# EAGLE design EYIC AD11 (EAGLE 9.6.2)
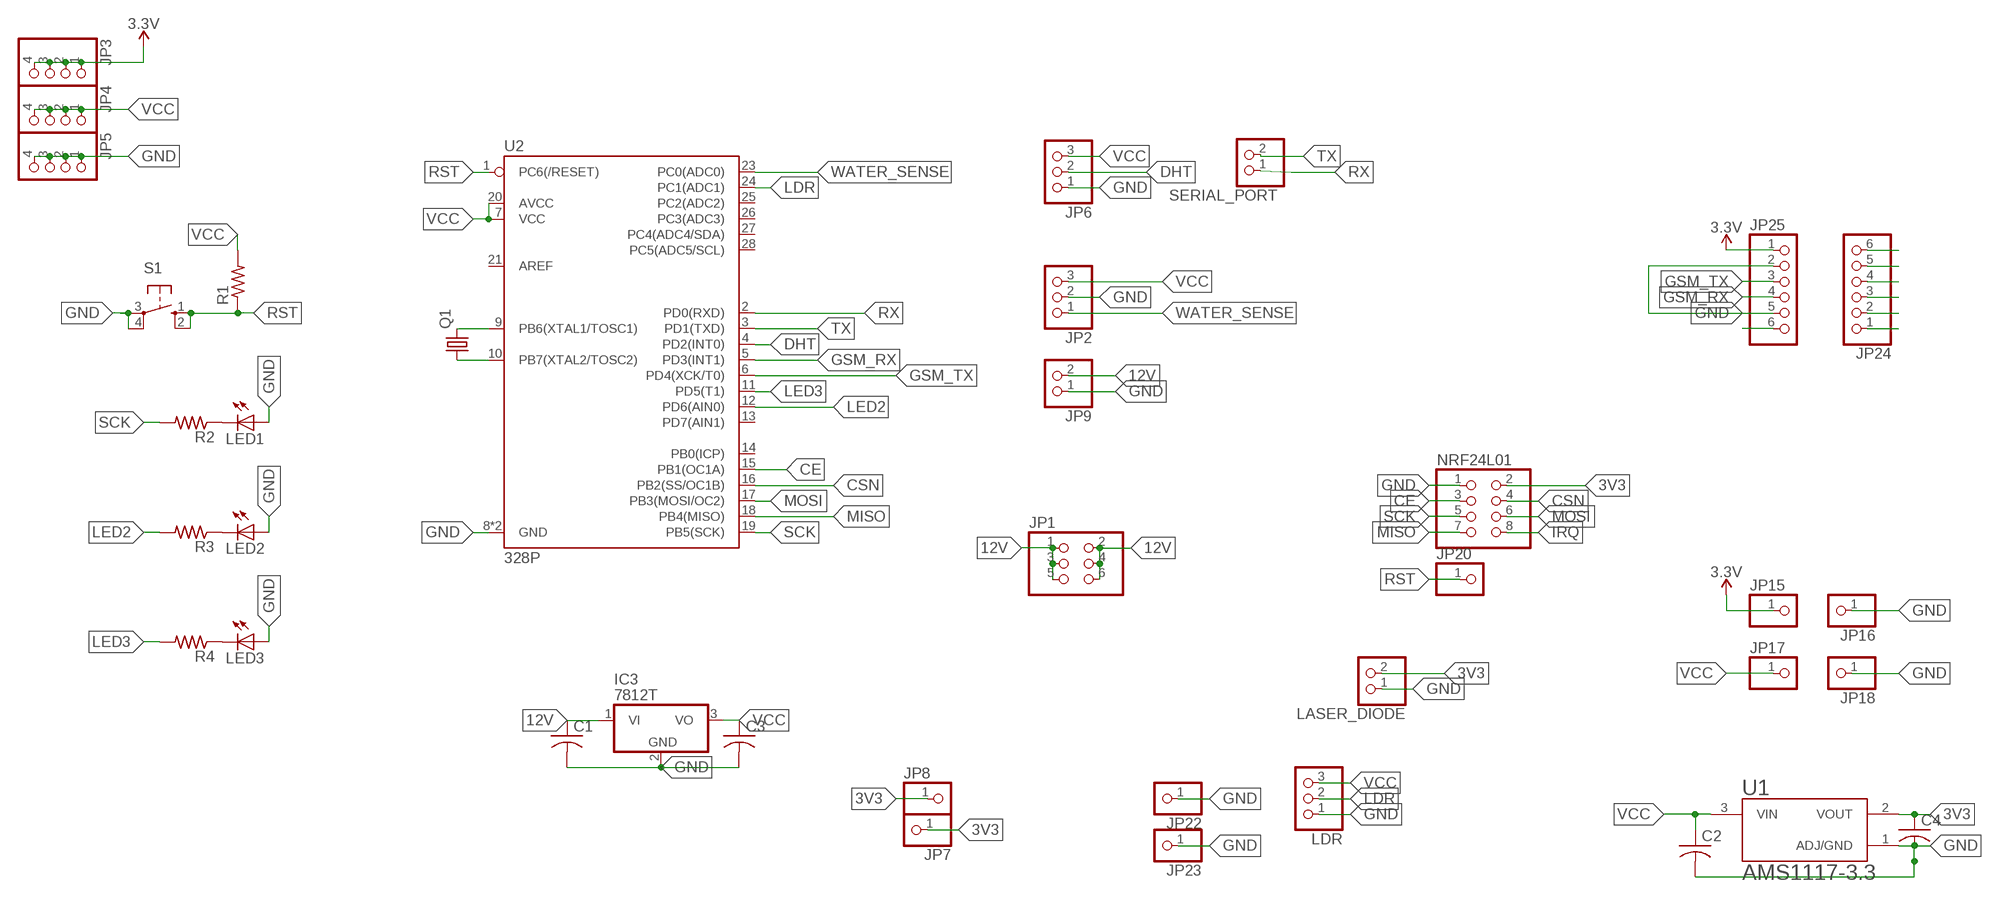
[diagram p0: schematic, sheet 1]

## Parts
C1  C-US050-035X075  [C050-035X075]
C2  C-US025-060X050  [C025-060X050]
C3  C-US050-035X075  [C050-035X075]
C4  C-US025-060X050  [C025-060X050]
IC3  7812T  [TO220H]
JP1  PINHD-2X3  [2X03]
JP2  PINHD-1X3  [1X03]
JP3  PINHD-1X4  [1X04]
JP4  PINHD-1X4  [1X04]
JP5  PINHD-1X4  [1X04]
JP6  PINHD-1X3  [1X03]
JP7  PINHD-1X1  [1X01]
JP8  PINHD-1X1  [1X01]
JP9  PINHD-1X2  [1X02]
JP15  PINHD-1X1  [1X01]
JP16  PINHD-1X1  [1X01]
JP17  PINHD-1X1  [1X01]
JP18  PINHD-1X1  [1X01]
JP20  PINHD-1X1  [1X01]
JP22  PINHD-1X1  [1X01]
JP23  PINHD-1X1  [1X01]
JP24  PINHD-1X6  [1X06]
JP25  PINHD-1X6  [1X06]
LASER_DIODE  PINHD-1X2  [1X02]
LDR  PINHD-1X3  [1X03]
LED1  LED5MM  [LED5MM]
LED2  LED5MM  [LED5MM]
LED3  LED5MM  [LED5MM]
NRF24L01  PINHD-2X4  [2X04]
Q1  CRYSTALHC49S  [HC49/S]
R1  R-US_0207/7  [0207/7]
R2  R-US_0207/7  [0207/7]
R3  R-US_0207/7  [0207/7]
R4  R-US_0207/7  [0207/7]
S1  10-XX  [B3F-10XX]
SERIAL_PORT  PINHD-1X2  [1X02]
U1  AMS1117-3.3  [SOT229P700X180-4N]
U2  328P  ATMEGA328P_PDIP  [DIP28]

## Nets
3.3V: JP3.1 JP3.2 JP3.3 JP3.4 JP15.1 JP25.1
3V3: C4.1 JP7.1 JP8.1 LASER_DIODE.2 NRF24L01.2 U1.2(VOUT)
12V: C1.1 IC3.1(VI) JP1.1 JP1.2 JP1.3 JP1.4 JP1.5 JP1.6 JP9.2
CE: NRF24L01.3 U2.15(PB1(OC1A))
CSN: NRF24L01.4 U2.16(PB2(SS/OC1B))
DHT: JP6.2 U2.4(PD2(INT0))
GND: C1.2 C2.2 C3.2 C4.2 IC3.2(GND) JP2.2 JP5.1 JP5.2 JP5.3 JP5.4 JP6.1 JP9.1 JP16.1 JP18.1 JP22.1 JP23.1 JP25.2 JP25.5 LASER_DIODE.1 LDR.1 LED1.A LED2.A LED3.A NRF24L01.1 S1.3(P) S1.4(P1) U1.1(ADJ/GND) U2.8(GND) U2.22(GND)
GSM_RX: JP25.4 U2.5(PD3(INT1))
GSM_TX: JP25.3 U2.6(PD4(XCK/T0))
IRQ: NRF24L01.8
LDR: LDR.2 U2.24(PC1(ADC1))
LED2: R3.2 U2.12(PD6(AIN0))
LED3: R4.2 U2.11(PD5(T1))
MISO: NRF24L01.7 U2.18(PB4(MISO))
MOSI: NRF24L01.6 U2.17(PB3(MOSI/OC2))
N$1: Q1.2 U2.9(PB6(XTAL1/TOSC1))
N$2: Q1.1 U2.10(PB7(XTAL2/TOSC2))
N$5: LED1.K(C) R2.1
N$8: LED2.K(C) R3.1
N$9: LED3.K(C) R4.1
N$11: JP25.6
N$12: JP24.6
N$13: JP24.5
N$14: JP24.4
N$15: JP24.3
N$16: JP24.2
N$17: JP24.1
RST: JP20.1 R1.1 S1.1(S) S1.2(S1) U2.1(PC6(/RESET))
RX: SERIAL_PORT.1 U2.2(PD0(RXD))
SCK: NRF24L01.5 R2.2 U2.19(PB5(SCK))
TX: SERIAL_PORT.2 U2.3(PD1(TXD))
VCC: C2.1 C3.1 IC3.3(VO) JP2.3 JP4.1 JP4.2 JP4.3 JP4.4 JP6.3 JP17.1 LDR.3 R1.2 U1.3(VIN) U2.7(VCC) U2.20(AVCC)
WATER_SENSE: JP2.1 U2.23(PC0(ADC0))
Unconnected: U2.13(PD7(AIN1)) U2.14(PB0(ICP)) U2.21(AREF) U2.25(PC2(ADC2)) U2.26(PC3(ADC3)) U2.27(PC4(ADC4/SDA)) U2.28(PC5(ADC5/SCL))

## Library data of the parts
C1-C4 = adafruit:C-US: CAPACITOR, American symbol
IC3 = adafruit:78*: Positive VOLTAGE REGULATOR Added bigger pads to the TO-92 package
JP1 = pinhead:PINHD-2X3: PIN HEADER
JP2 JP6 LDR = adafruit:PINHD-1X3: PIN HEADER
JP3-JP5 = pinhead:PINHD-1X4: PIN HEADER
JP7 JP8 JP15-JP18 JP20 JP22 JP23 = adafruit:PINHD-1X1: Pin header 1x1 for 0.1" spacing With round pins
JP9 LASER_DIODE SERIAL_PORT = pinhead:PINHD-1X2: PIN HEADER
JP24 JP25 = adafruit:PINHD-1X6: PIN HEADER; SPICEPREFIX: X
LED1-LED3 = adafruit:LED: LED OSRAM: - CHIPLED LG R971, LG N971, LY N971, LG Q971, LY Q971, LO R971, LY R971 LH N974, LH R974 LS Q976, LO Q976, LY Q976 LO Q996 - Hyper CHIPLED LW Q18S LB Q993, LB Q99A, LB R99A - SideLED LS A670, LO A670, LY A670, LG A670, LP A670 LB A673, LV A673, LT A673, LW A673 LH A674 LY A675 LS A676, LA A676, LO A676, LY A676, LW A676 LS A679, LY A679, LG A679 - Hyper Micro SIDELED® LS Y876, LA Y876, LO Y876, LY Y876 LT Y87S - SmartLED LW L88C, LW L88S LB L89C, LB L89S, LG L890 LS L89K, LO L89K, LY L89K LS L896, LA L896, LO L896, LY L896 - TOPLED LS T670, LO T670, LY T670, LG T670, LP T670 LSG T670, LSP T670, LSY T670, LOP T670, LYG T670 LG T671, LOG T671, LSG T671 LB T673, LV T673, LT T673, LW T673 LH T674 LS T676, LA T676, LO T676, LY T676, LB T676, LH T676, LSB T676, LW T676 LB T67C, LV T67C, LT T67C, LS T67K, LO T67K, LY T67K, LW E67C LS E67B, LA E67B, LO E67B, LY E67B, LB E67C, LV E67C, LT E67C LW T67C LS T679, LY T679, LG T679 LS T770, LO T770, LY T770, LG T770, LP T770 LB T773, LV T773, LT T773, LW T773 LH T774 LS E675, LA E675, LY E675, LS T675 LS T776, LA T776, LO T776, LY T776, LB T776 LHGB T686 LT T68C, LB T68C - Hyper Mini TOPLED® LB M676 - Mini TOPLED Santana® LG M470 LS M47K, LO M47K, LY M47K Source: http://www.osram.convergy.de/
NRF24L01 = adafruit:PINHD-2X4: PIN HEADER
Q1 = crystal:CRYSTAL: CRYSTAL; OC_FARNELL: 1667008; OC_NEWARK: unknown
R1-R4 = adafruit:R-US_: RESISTOR, American symbol
S1 = switch-omron:10-XX: OMRON SWITCH; MPN: B3F-1000; OC_FARNELL: 176432; OC_NEWARK: 36M3542
U1 = AMS1117-3.3:AMS1117-3.3: Sot223/Pkg 1-Amp 3.3-Volt Low Drop Out Voltage Regulatator; AVAILABILITY: Unavailable; DESCRIPTION: Sot-89; MF: Advanced Monolithic Systems; MP: AMS1117-3.3; PACKAGE: SOT-89 ams; PRICE: None
U2 = SparkFun-IC-Microcontroller:ATMEGA328P_PDIP: Atmel 328P Through hole ATMEGA328P uC used in the Arduino 32kb flash, 1k EEPROM, 2k SRAM Datasheet <http://www.sparkfun.com/datasheets/Components/SMD/ATMega328.pdf> SparkFun Products Storefront component: AVR 28 Pin 20MHz 32K 6A/D - ATMega328P <https://www.sparkfun.com/products/9061> (COM-09061) SparkFun Simon Says - Through-Hole Soldering Kit <https://www.sparkfun.com/products/10547> (KIT-10547) SparkFun Learn to Solder - Simon Says <https://www.sparkfun.com/products/13708> (KIT-13708) SparkFun BigTime Watch Kit <https://www.sparkfun.com/products/11734> (KIT-11734) SparkFun ClockIt <https://www.sparkfun.com/products/10930> (KIT-10930) SparkFun Serial Enabled LCD Kit <https://www.sparkfun.com/products/10097> (LCD-10097) SparkFun Simon Tilts - Through Hole Soldering Kit <https://www.sparkfun.com/products/12634> (KIT-12634) SparkFun Frequency Counter Kit <https://www.sparkfun.com/products/10140> (KIT-10140) FabFM Radio Kit <https://www.sparkfun.com/products/11043> (KIT-11043) SparkFun Binary Blaster Kit <https://www.sparkfun.com/products/12037> (KIT-12037) SparkFun Metro-Gnome <https://www.sparkfun.com/products/9236> (KIT-09236) ATmega328 with Arduino Optiboot (Uno) <https://www.sparkfun.com/products/10524> (DEV-10524); PROD_ID: IC-09136

## Net classes
1 New Class: width 1.016 mm

## Board
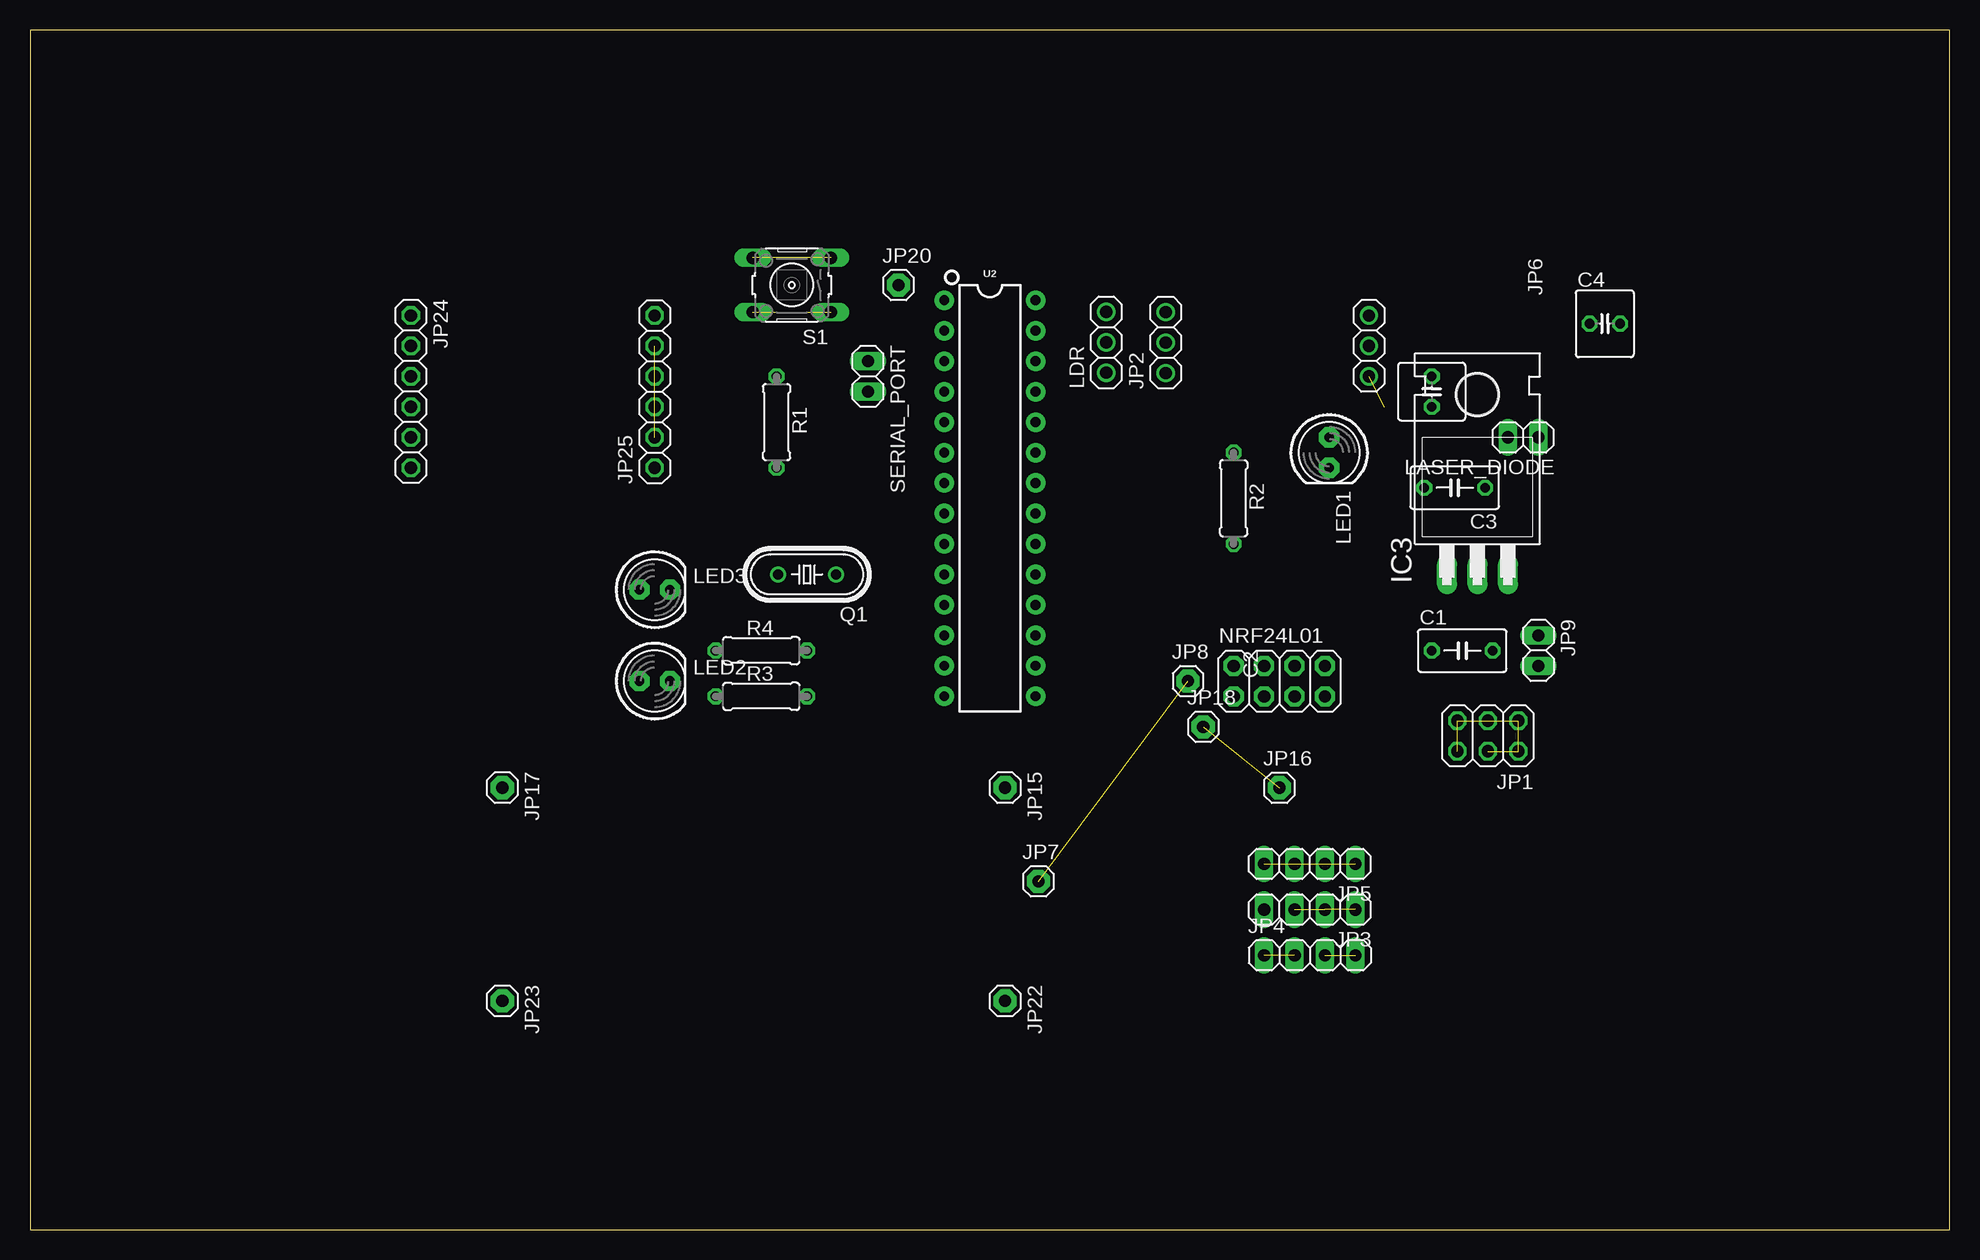
[diagram p1: board, top side]
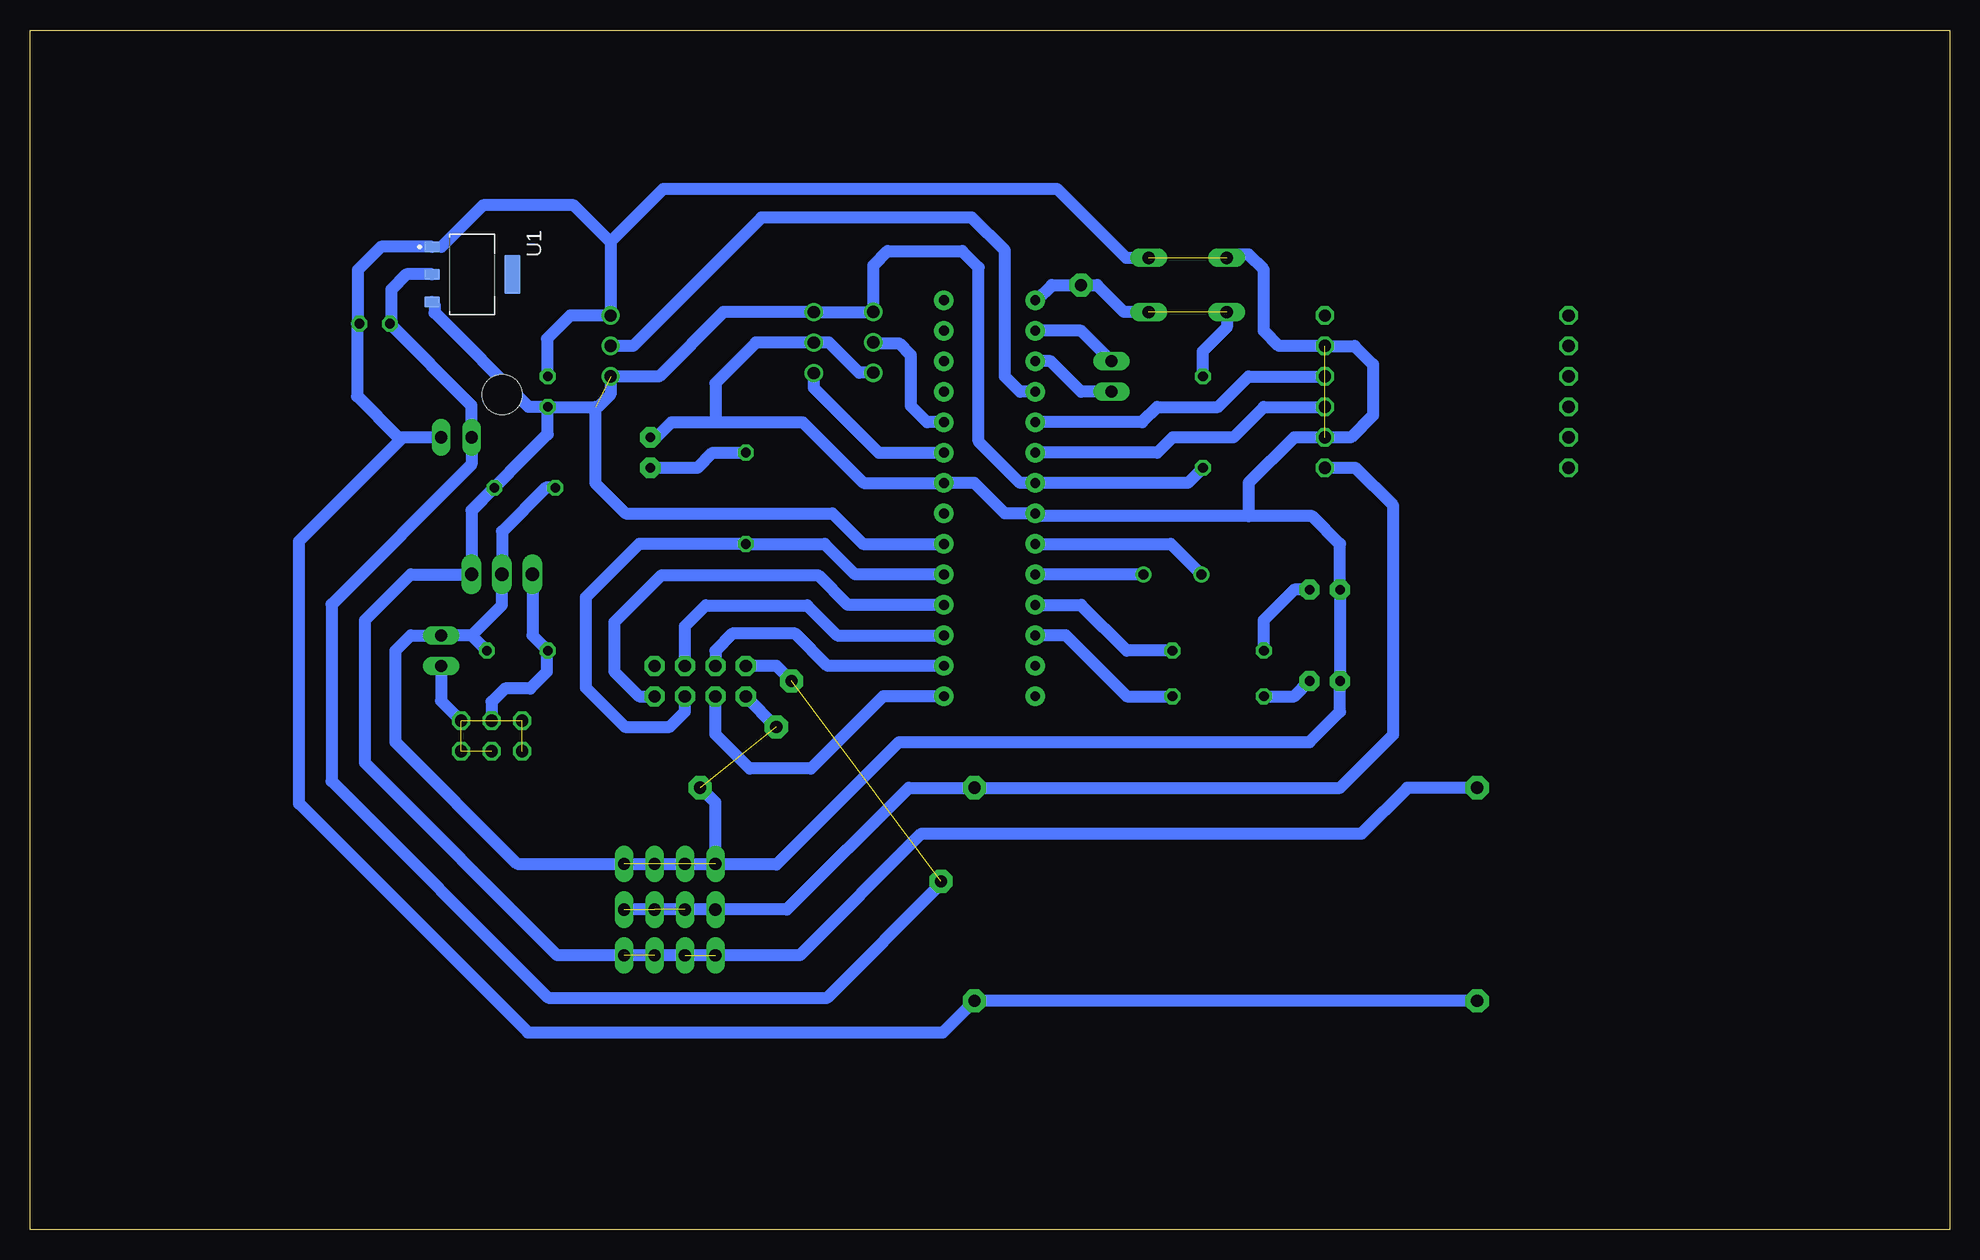
[diagram p2: board, bottom side, seen from below]

Size 160 x 100 mm. Coordinates in mm from the lower left corner, seen from the top.
Outline: 0,0 160,0 160,100 0,100 0,0
Copper layers (1*16): Top 0.035mm / dielectric 1.5mm / Bottom 0.035mm
Design rules "default *": minimum track width 6mil, minimum drill 0.35mm, track to track 6mil, track to pad 6mil, pad to pad 6mil, via to via 6mil, smd to smd 6mil, copper to edge 40mil, drill to drill 6mil, minimum pad ring 10mil, minimum via ring 8mil, stop-mask expansion 4mil, vias tented up to drill 0mil, thermal gap 10mil

### Footprints (pad centres in the part's own frame; a part is rotated, then mirrored left to right if it is on the bottom)
C050-035X075 = drill 0.813 octagon: 1 -2.54,0; 2 2.54,0
C025-060X050 = drill 0.813 octagon: 1 -1.27,0; 2 1.27,0
TO220H = drill 1.118 long: 1 -2.54,-10.16; 2 0,-10.16; 3 2.54,-10.16 | hole 3.302: 0,4.826
2X03 = drill 1.016 octagon: 1 -2.54,-1.27; 2 -2.54,1.27; 3 0,-1.27; 4 0,1.27; 5 2.54,-1.27; 6 2.54,1.27
1X03 = drill 1.016: 1 -2.54,0; 2 0,0; 3 2.54,0
1X04 = drill 1.016 long: 1 -3.81,0; 2 -1.27,0; 3 1.27,0; 4 3.81,0
1X01 = drill 1.016 pad 1.93 octagon: 1 0,0
1X02 = drill 1.016 long: 1 -1.27,0; 2 1.27,0
1X06 = drill 1.016 octagon: 1 -6.35,0; 2 -3.81,0; 3 -1.27,0; 4 1.27,0; 5 3.81,0; 6 6.35,0
LED5MM = drill 0.813 pad 1.676 octagon: A -1.27,0; K 1.27,0
2X04 = drill 1.016 pad 1.676 octagon: 1 -3.81,-1.27; 2 -3.81,1.27; 3 -1.27,-1.27; 4 -1.27,1.27; 5 1.27,-1.27; 6 1.27,1.27; 7 3.81,-1.27; 8 3.81,1.27
HC49/S = drill 0.813: 1 -2.413,0; 2 2.413,0
0207/7 = drill 0.813 octagon: 1 -3.81,0; 2 3.81,0
B3F-10XX = drill 1.016 long: 1 -3.251,2.261; 2 3.251,2.261; 3 -3.251,-2.261; 4 3.251,-2.261
SOT229P700X180-4N = smd 0.93 x 1.31: 1 -2.29,-3.345; 2 0,-3.345; 3 2.29,-3.345 | smd 3.24 x 1.31: 4 0,3.345
DIP28 = drill 0.813 pad 1.626: 1 -16.51,-3.81; 2 -13.97,-3.81; 3 -11.43,-3.81; 4 -8.89,-3.81; 5 -6.35,-3.81; 6 -3.81,-3.81; 7 -1.27,-3.81; 8 1.27,-3.81; 9 3.81,-3.81; 10 6.35,-3.81; 11 8.89,-3.81; 12 11.43,-3.81; 13 13.97,-3.81; 14 16.51,-3.81; 15 16.51,3.81; 16 13.97,3.81; 17 11.43,3.81; 18 8.89,3.81; 19 6.35,3.81; 20 3.81,3.81; 21 1.27,3.81; 22 -1.27,3.81; 23 -3.81,3.81; 24 -6.35,3.81; 25 -8.89,3.81; 26 -11.43,3.81; 27 -13.97,3.81; 28 -16.51,3.81

### Placement (x,y rotation side)
C1  119.38,48.26 0 top
C2  116.84,69.85 90 top
C3  118.76,61.84 180 top
C4  131.27,75.51 0 top
IC3  120.65,64.77 0 top
JP1  121.52,41.14 180 top
JP2  94.67,73.94 90 top
JP3  106.68,26.67 180 top
JP4  106.68,22.86 0 top
JP5  106.68,30.48 180 top
JP6  111.61,73.66 270 top
JP7  84.06,29.03 0 top
JP8  96.52,45.72 0 top
JP9  125.73,48.26 270 top
JP15  81.28,36.83 270 top
JP16  104.14,36.83 0 top
JP17  39.37,36.83 270 top
JP18  97.79,41.91 0 top
JP20  72.39,78.74 0 top
JP22  81.28,19.05 270 top
JP23  39.37,19.05 270 top
JP24  31.75,69.85 270 top
JP25  52.07,69.85 90 top
LASER_DIODE  124.46,66.04 180 top
LDR  89.7,73.97 90 top
LED1  108.29,64.77 270 top
LED2  52.07,45.72 0 top
LED3  52.07,53.34 0 top
NRF24L01  104.14,45.72 0 top
Q1  64.77,54.61 180 top
R1  62.23,67.31 270 top
R2  100.33,60.96 270 top
R3  60.96,44.45 0 top
R4  60.96,48.26 0 top
S1  63.5,78.74 180 top
SERIAL_PORT  69.85,71.12 270 top
U1  123.15,79.63 270 bottom
U2  80.01,60.96 270 top

### Tracks (layer width: path | path; a pad name or v marks a point on that pad's centre or on a via)
3.3V  (2 unrouted)
  Bottom 1.016: JP3.1 JP3.4 96.92,26.67 86.76,36.83 JP15.1 50.8,36.83 46.37,41.26 46.37,60.34 49.53,63.5 JP25.1
3V3  (1 unrouted)
  Bottom 1.016: U1.2 128.6,79.63 129.88,78.36 129.88,75.64 C4.1 123.19,68.71 LASER_DIODE.2 123.19,63.79 134.86,52.12 134.86,37.38 116.8,19.32 93.54,19.32 84.06,28.8 JP7.1 | JP8.1 97.79,46.99 NRF24L01.2
12V  (5 unrouted)
  Bottom 1.016: IC3.1 118.11,49.53 C1.1 116.92,48.18 116.92,46.48 118.3,45.1 120.41,45.1 121.52,43.99 JP1.3 | JP9.2 125.73,44.08 JP1.1
CE
  Bottom 1.016: U2.15 88.89,44.45 94.91,38.42 100.01,38.42 102.87,41.28 NRF24L01.3
CSN
  Bottom 1.016: NRF24L01.4 102.87,48.26 101.46,49.67 96.19,49.67 93.51,46.99 U2.16
DHT
  Bottom 1.016: U2.4 77.47,69.85 78.74,71.12 78.74,81.61 81.5,84.37 99.02,84.37 109.73,73.66 JP6.2
GND  (6 unrouted)
  Bottom 0.61: 125.69,81.92 U1.1 125.44,81.92 | 75.97,59.46 U2.8
  Bottom 1.016: LED1.A 107.8,66.04 106.53,67.31 102.87,67.31 | 102.87,67.31 95.6,67.31 90.52,62.23 U2.22 81.28,62.23 78.74,59.69 U2.8 | 123.19,49.53 120.65,52.07 IC3.2 120.65,58.19 117.01,61.84 C3.2 | 111.61,82.31 114.68,85.38 122.24,85.38 125.69,81.92 | U1.1 130.74,81.92 132.68,79.98 132.68,75.39 | 123.19,49.53 C1.2 | 123.19,49.53 JP9.1 128.27,49.53 129.54,48.26 129.54,40.64 119.38,30.48 JP5.4 | 116.84,71.36 C2.2 116.91,71.19 116.91,74.25 114.97,76.2 JP6.1 111.61,82.31 | 102.87,67.31 102.87,70.56 99.49,73.94 JP2.2 93.41,73.94 90.89,71.42 LDR.1 | 58.42,59.46 53.11,59.46 50.8,57.15 LED3.A LED2.A 50.8,43.18 53.34,40.64 87.56,40.64 97.77,30.43 102.82,30.43 JP5.4 | 58.42,59.46 75.97,59.46 | JP16.1 104.09,36.83 102.87,35.61 JP5.4 | 97.83,41.91 JP18.1 NRF24L01.1 | JP23.1 JP22.1 83.9,16.43 118.5,16.43 137.57,35.51 137.57,57.39 128.92,66.04 LASER_DIODE.1 129.3,66.04 132.73,69.47 132.73,75.51 C4.2 | 111.61,82.31 111.61,82.35 107.19,86.77 74.4,86.77 68.64,81 S1.3 | S1.4 59.97,81.28 58.42,81.28 57.15,80.01 57.15,74.93 55.88,73.66 JP25.5 49.6,73.66 48.05,72.11 48.05,67.89 49.9,66.04 54.61,66.04 58.42,62.23 58.42,59.46
GSM_RX
  Bottom 1.016: U2.5 67.31,67.31 66.04,68.58 60.96,68.58 58.42,71.12 JP25.4
GSM_TX
  Bottom 1.016: U2.6 66.04,64.77 64.77,66.04 59.69,66.04 57.15,68.58 JP25.3
LDR
  Bottom 1.016: LDR.2 89.62,73.88 87.57,73.88 86.59,72.9 86.59,68.67 85.23,67.31 U2.24
LED2
  Bottom 1.016: U2.12 73.66,49.53 68.58,44.45 R3.2
LED3
  Bottom 1.016: U2.11 72.39,52.07 68.58,48.26 R4.2
MISO
  Bottom 1.016: U2.18 91.85,52.07 94.33,54.55 107.35,54.55 111.3,50.61 111.3,46.52 109.22,44.45 NRF24L01.7
MOSI
  Bottom 1.016: NRF24L01.6 105.41,50.3 103.68,52.03 95.21,52.03 92.71,49.53 U2.17
N$1
  Bottom 1.016: U2.9 64.9,57.15 Q1.2
N$2
  Bottom 1.016: Q1.1 U2.10
N$5
  Bottom 1.016: R2.1 103.1,64.77 104.37,63.5 LED1.K
N$8
  Bottom 1.016: R3.1 54.61,44.45 LED2.K
N$9
  Bottom 1.016: R4.1 57.15,50.8 54.61,53.34 LED3.K
RST  (1 unrouted)
  Bottom 0.61: 62.23,71.4 R1.1
  Bottom 1.016: S1.1 68.8,76.48 71.06,78.74 JP20.1 74.83,78.74 76.1,77.47 U2.1 | R1.1 62.23,73.23 60.25,75.21 S1.2
RX
  Bottom 1.016: SERIAL_PORT.1 72.39,74.93 U2.2
SCK
  Bottom 1.016: U2.19 91.22,54.61 93.76,57.15 R2.2 109.22,57.15 113.68,52.69 113.68,45.18 110.41,41.91 106.68,41.91 105.41,43.18 NRF24L01.5
TX
  Bottom 1.016: SERIAL_PORT.2 72.39,69.85 74.93,72.39 U2.3
VCC  (3 unrouted)
  Bottom 0.61: LDR.3
  Bottom 1.016: 112.86,68.58 112.88,68.56 112.88,62.23 110.34,59.69 93.11,59.69 90.57,57.15 U2.20 | R1.2 63.5,62.23 U2.7 77.47,62.23 80.93,65.69 80.93,80.21 82.3,81.57 88.51,81.57 89.71,80.37 LDR.3 | 123.19,59.95 IC3.3 128.27,54.61 132.08,50.8 132.08,38.9 116.04,22.86 JP4.4 JP4.1 95.83,22.86 85.67,33.02 49,33.02 45.19,36.83 JP17.1 | C2.1 118.44,68.58 126.28,76.42 126.28,77.13 U1.3 | LDR.3 89.72,76.48 JP2.3 102.21,76.48 107.58,71.12 JP6.3 111.61,69.62 112.65,68.58 C2.1 | 123.19,59.95 116.84,66.31 C2.1 | C3.1 123.18,59.95 123.19,59.95
WATER_SENSE
  Bottom 1.016: JP2.1 94.67,70.18 89.26,64.77 U2.23